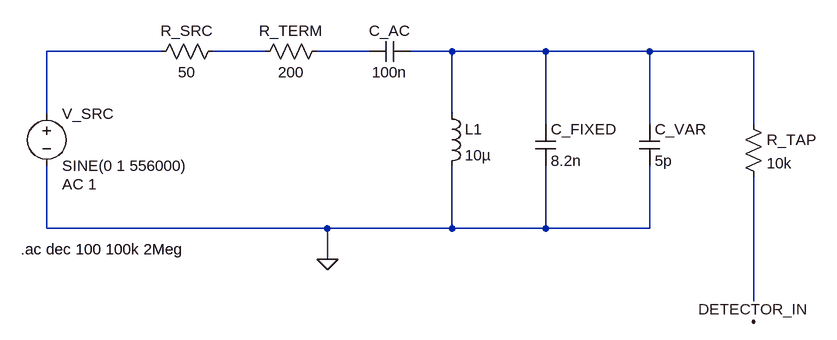
[diagram p0: schematic LC Resonator Frequency Response.asc]
LC Resonator Frequency Response.asc, the LTspice schematic file:
Version 4.1
SHEET 1 1236 680
WIRE 48 112 -128 112
WIRE 208 112 128 112
WIRE 368 112 288 112
WIRE 496 112 432 112
WIRE 640 112 496 112
WIRE 800 112 640 112
WIRE 960 112 800 112
WIRE -128 208 -128 112
WIRE 496 208 496 112
WIRE 640 224 640 112
WIRE 800 224 800 112
WIRE 960 224 960 112
WIRE -128 384 -128 288
WIRE 304 384 -128 384
WIRE 496 384 496 288
WIRE 496 384 304 384
WIRE 640 384 640 288
WIRE 640 384 496 384
WIRE 800 384 800 288
WIRE 800 384 640 384
WIRE 304 432 304 384
WIRE 960 496 960 304
FLAG 960 528 DETECTOR_IN
FLAG 304 432 0
SYMBOL voltage -128 192 R0
WINDOW 123 24 124 Left 2
WINDOW 39 0 0 Left 0
SYMATTR InstName V_SRC
SYMATTR Value SINE(0 1 556000)
SYMATTR Value2 AC 1
SYMBOL res 304 96 R90
WINDOW 0 0 56 VBottom 2
WINDOW 3 32 56 VTop 2
SYMATTR InstName R_TERM
SYMATTR Value 200
SYMBOL res 944 208 R0
SYMATTR InstName R_TAP
SYMATTR Value 10k
SYMBOL cap 432 96 R90
WINDOW 0 0 32 VBottom 2
WINDOW 3 32 32 VTop 2
SYMATTR InstName C_AC
SYMATTR Value 100n
SYMBOL ind 480 192 R0
SYMATTR InstName L1
SYMATTR Value 10µ
SYMATTR SpiceLine Rser=0.5
SYMBOL res 144 96 R90
WINDOW 0 0 56 VBottom 2
WINDOW 3 32 56 VTop 2
SYMATTR InstName R_SRC
SYMATTR Value 50
SYMBOL cap 624 224 R0
SYMATTR InstName C_FIXED
SYMATTR Value 8.2n
SYMATTR SpiceLine Rser=0
SYMBOL cap 784 224 R0
SYMATTR InstName C_VAR
SYMATTR Value 5p
TEXT -168 416 Left 2 !.ac dec 100 100k 2Meg

The netlist it stands for:
* LC Resonator Frequency Response.asc
V_SRC N001 0 SINE(0 1 556000) AC 1
R_TERM N003 N002 200
R_TAP N004 N005 10k
C_AC N004 N003 100n
L1 N004 0 10µ Rser=0.5
R_SRC N002 N001 50
C_FIXED N004 0 8.2n Rser=0
C_VAR N004 0 5p
.ac dec 100 100k 2Meg
.backanno
.end